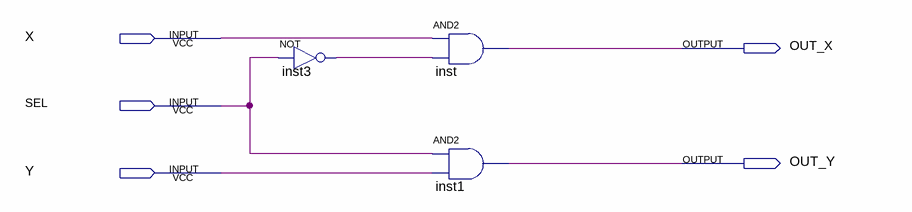
[diagram p0: schematic sheet]
// Quartus schematic Alternadora.bdf as structural Verilog: 3 symbols, 5 pins
module Alternadora (
  input  X,
  input  SEL,
  input  Y,
  output OUT_X,
  output OUT_Y
);

  wire inst3_out;

  not inst3 (inst3_out, SEL);
  and inst (OUT_X, X, inst3_out);
  and inst1 (OUT_Y, SEL, Y);
endmodule
